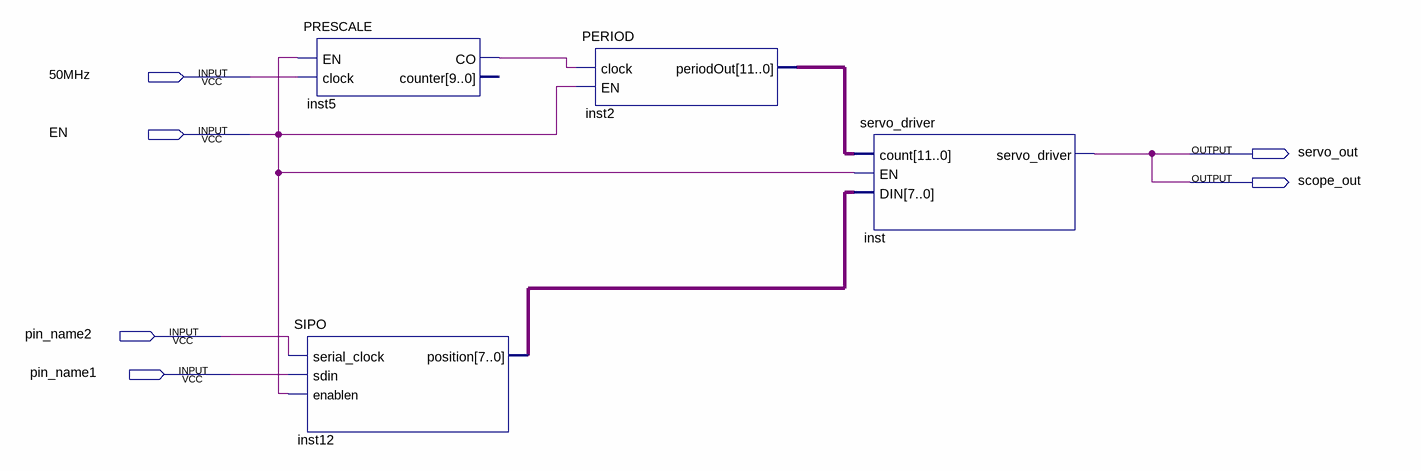
[diagram p0: schematic sheet]
// Quartus schematic Lab_11.bdf as structural Verilog: 4 symbols, 6 pins
module Lab_11 (
  input  \50MHz ,
  input  EN,
  input  pin_name2,
  input  pin_name1,
  output servo_out,
  output scope_out
);

  wire inst5_co;
  wire [7:0] inst12_position;
  wire [11:0] inst2_periodout;

  PRESCALE inst5 (.EN(EN), .clock(\50MHz ), .CO(inst5_co));  // open: counter
  SIPO inst12 (.serial_clock(pin_name2), .sdin(pin_name1), .enablen(EN), .position(inst12_position));
  PERIOD inst2 (.clock(inst5_co), .EN(EN), .periodOut(inst2_periodout));
  servo_driver inst (.count(inst2_periodout), .EN(EN), .DIN(inst12_position), .servo_driver(scope_out));

  assign servo_out = scope_out;
endmodule
